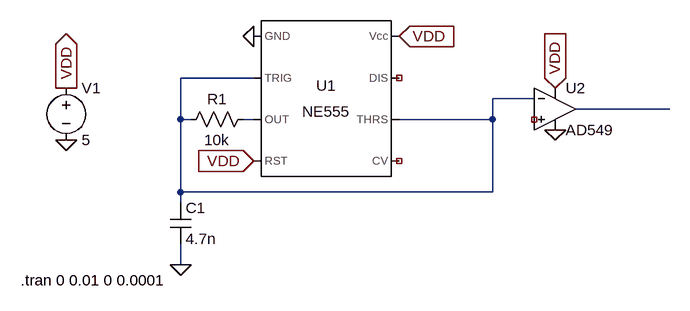
[diagram p0: schematic Draft2.asc]
Draft2.asc, the LTspice schematic file:
Version 4
SHEET 1 880 680
WIRE 0 128 -112 128
WIRE 432 160 368 160
WIRE 640 176 496 176
WIRE -112 192 -112 128
WIRE -96 192 -112 192
WIRE 0 192 -16 192
WIRE 368 192 368 160
WIRE 368 192 224 192
WIRE -112 304 -112 192
WIRE 368 304 368 192
WIRE 368 304 -112 304
WIRE -112 320 -112 304
WIRE -112 416 -112 384
FLAG -288 224 0
FLAG 0 64 0
FLAG -288 144 VDD
IOPIN -288 144 Out
FLAG 224 64 VDD
IOPIN 224 64 In
FLAG 0 256 VDD
IOPIN 0 256 In
FLAG -112 416 0
FLAG 464 144 VDD
IOPIN 464 144 In
FLAG 464 208 0
SYMBOL Misc\\NE555 112 160 R0
SYMATTR InstName U1
SYMBOL voltage -288 128 R0
WINDOW 123 0 0 Left 0
WINDOW 39 0 0 Left 0
SYMATTR InstName V1
SYMATTR Value 5
SYMBOL OpAmps\\AD549 464 112 R0
SYMATTR InstName U2
SYMBOL res 0 176 R90
WINDOW 0 0 56 VBottom 2
WINDOW 3 32 56 VTop 2
SYMATTR InstName R1
SYMATTR Value 10k
SYMBOL cap -128 320 R0
SYMATTR InstName C1
SYMATTR Value 4.7n
TEXT -358 440 Left 2 !.tran 0 0.01 0 0.0001

The netlist it stands for:
* Draft2.asc
XU1 0 N001 N003 VDD NC_01 N001 NC_02 VDD NE555  ; pins GND TRIG OUT RST CV THRS DIS Vcc
V1 VDD 0 5
XU2 NC_03 N001 VDD 0 N002 AD549  ; pins In+ In- V+ V- OUT
R1 N003 N001 10k
C1 N001 0 4.7n
.tran 0 0.01 0 0.0001
.lib NE555.sub
.backanno
.end